# Altium project JESC.PrjPcb
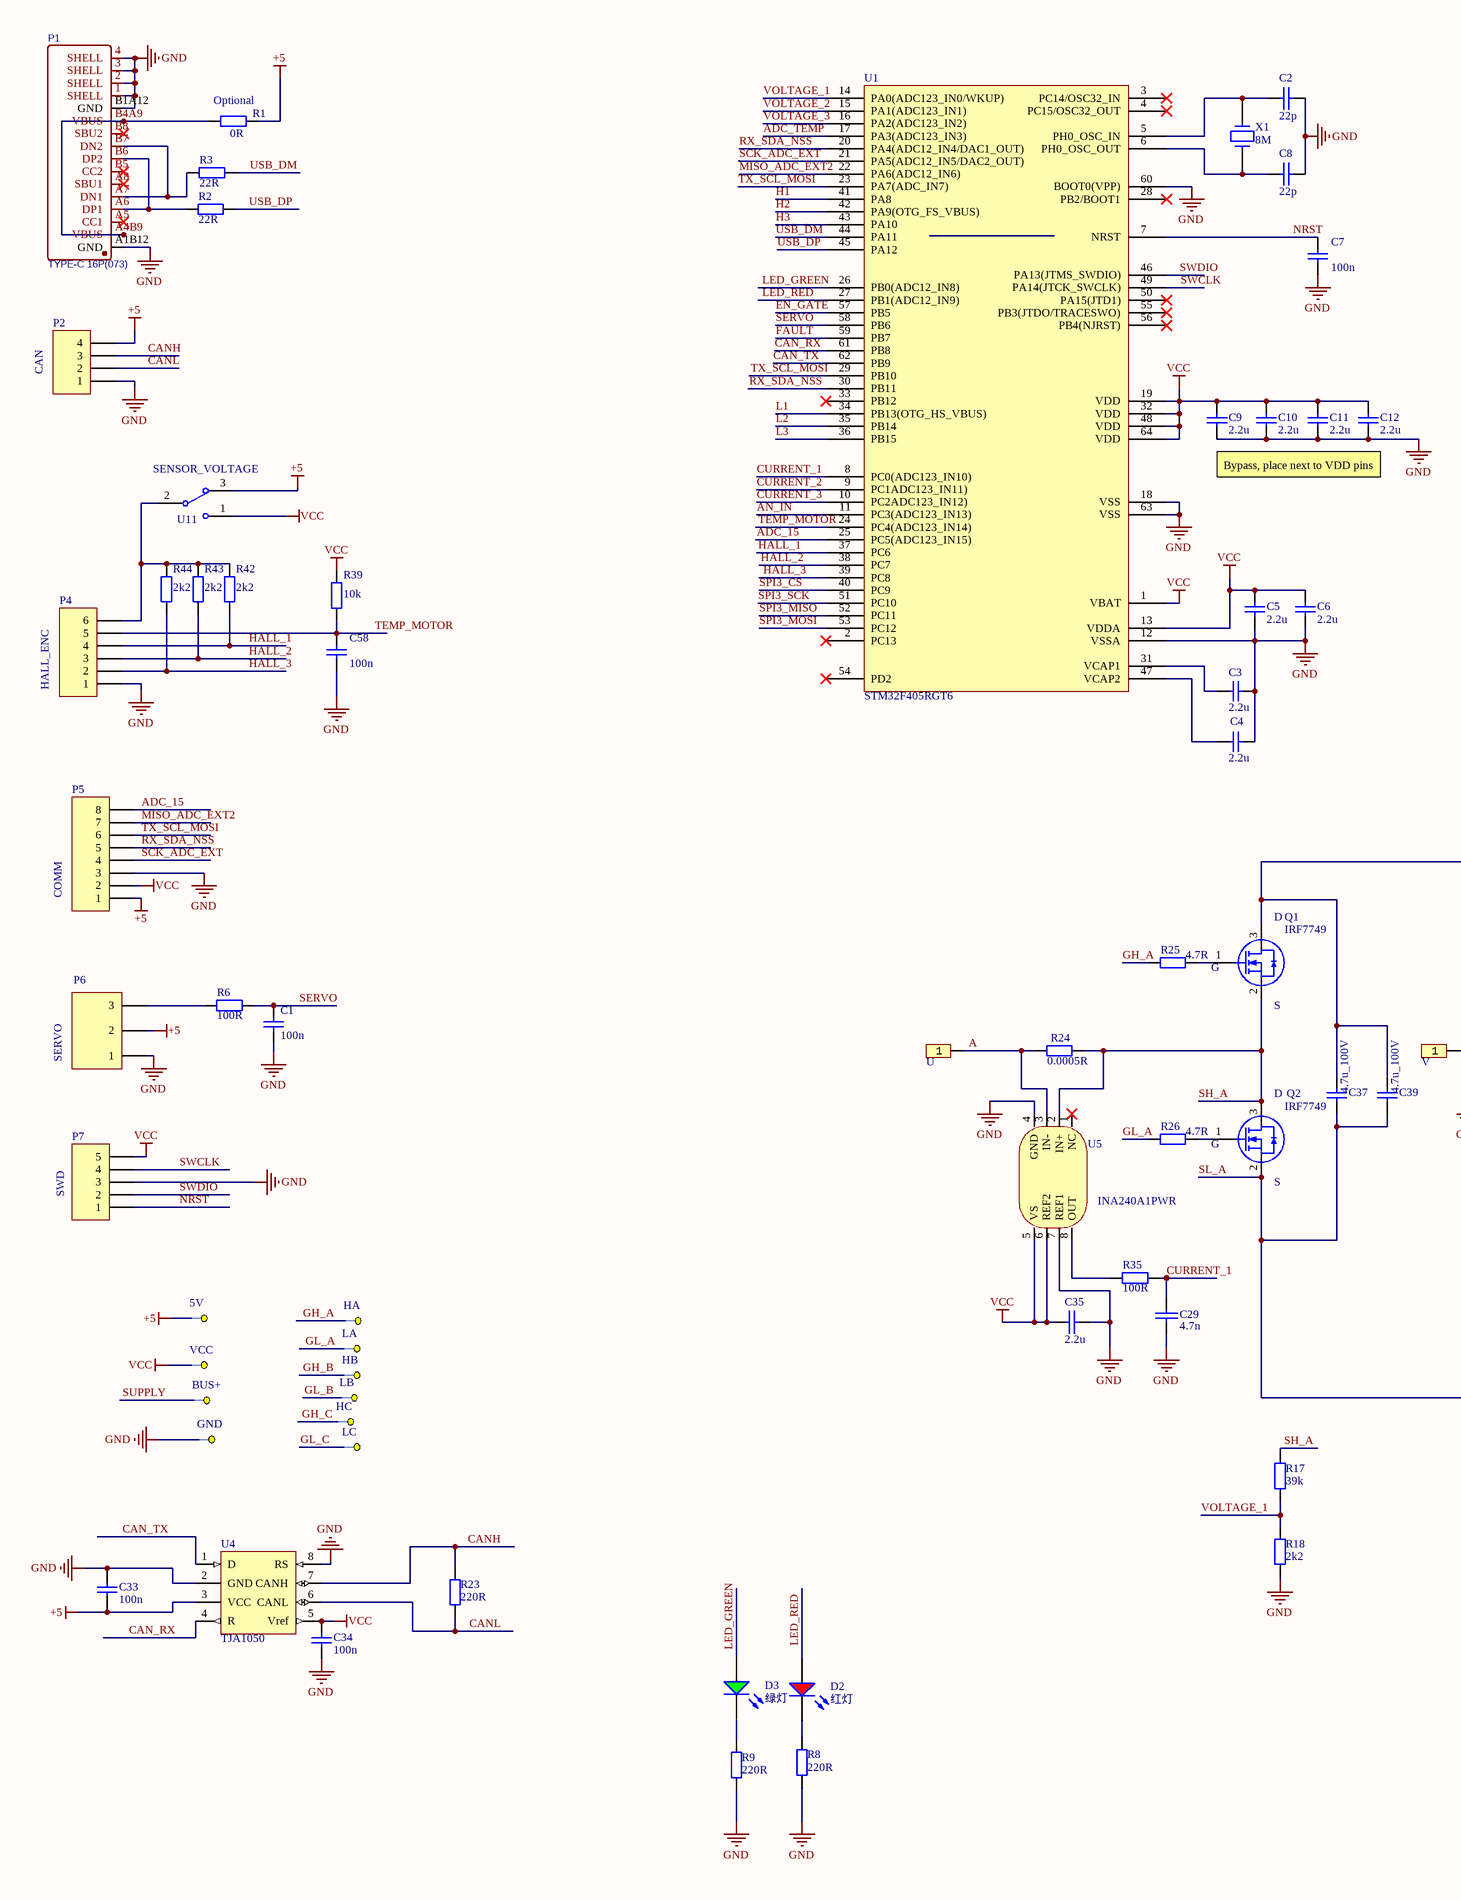
[diagram p0: VESC6.4.SchDoc, left]
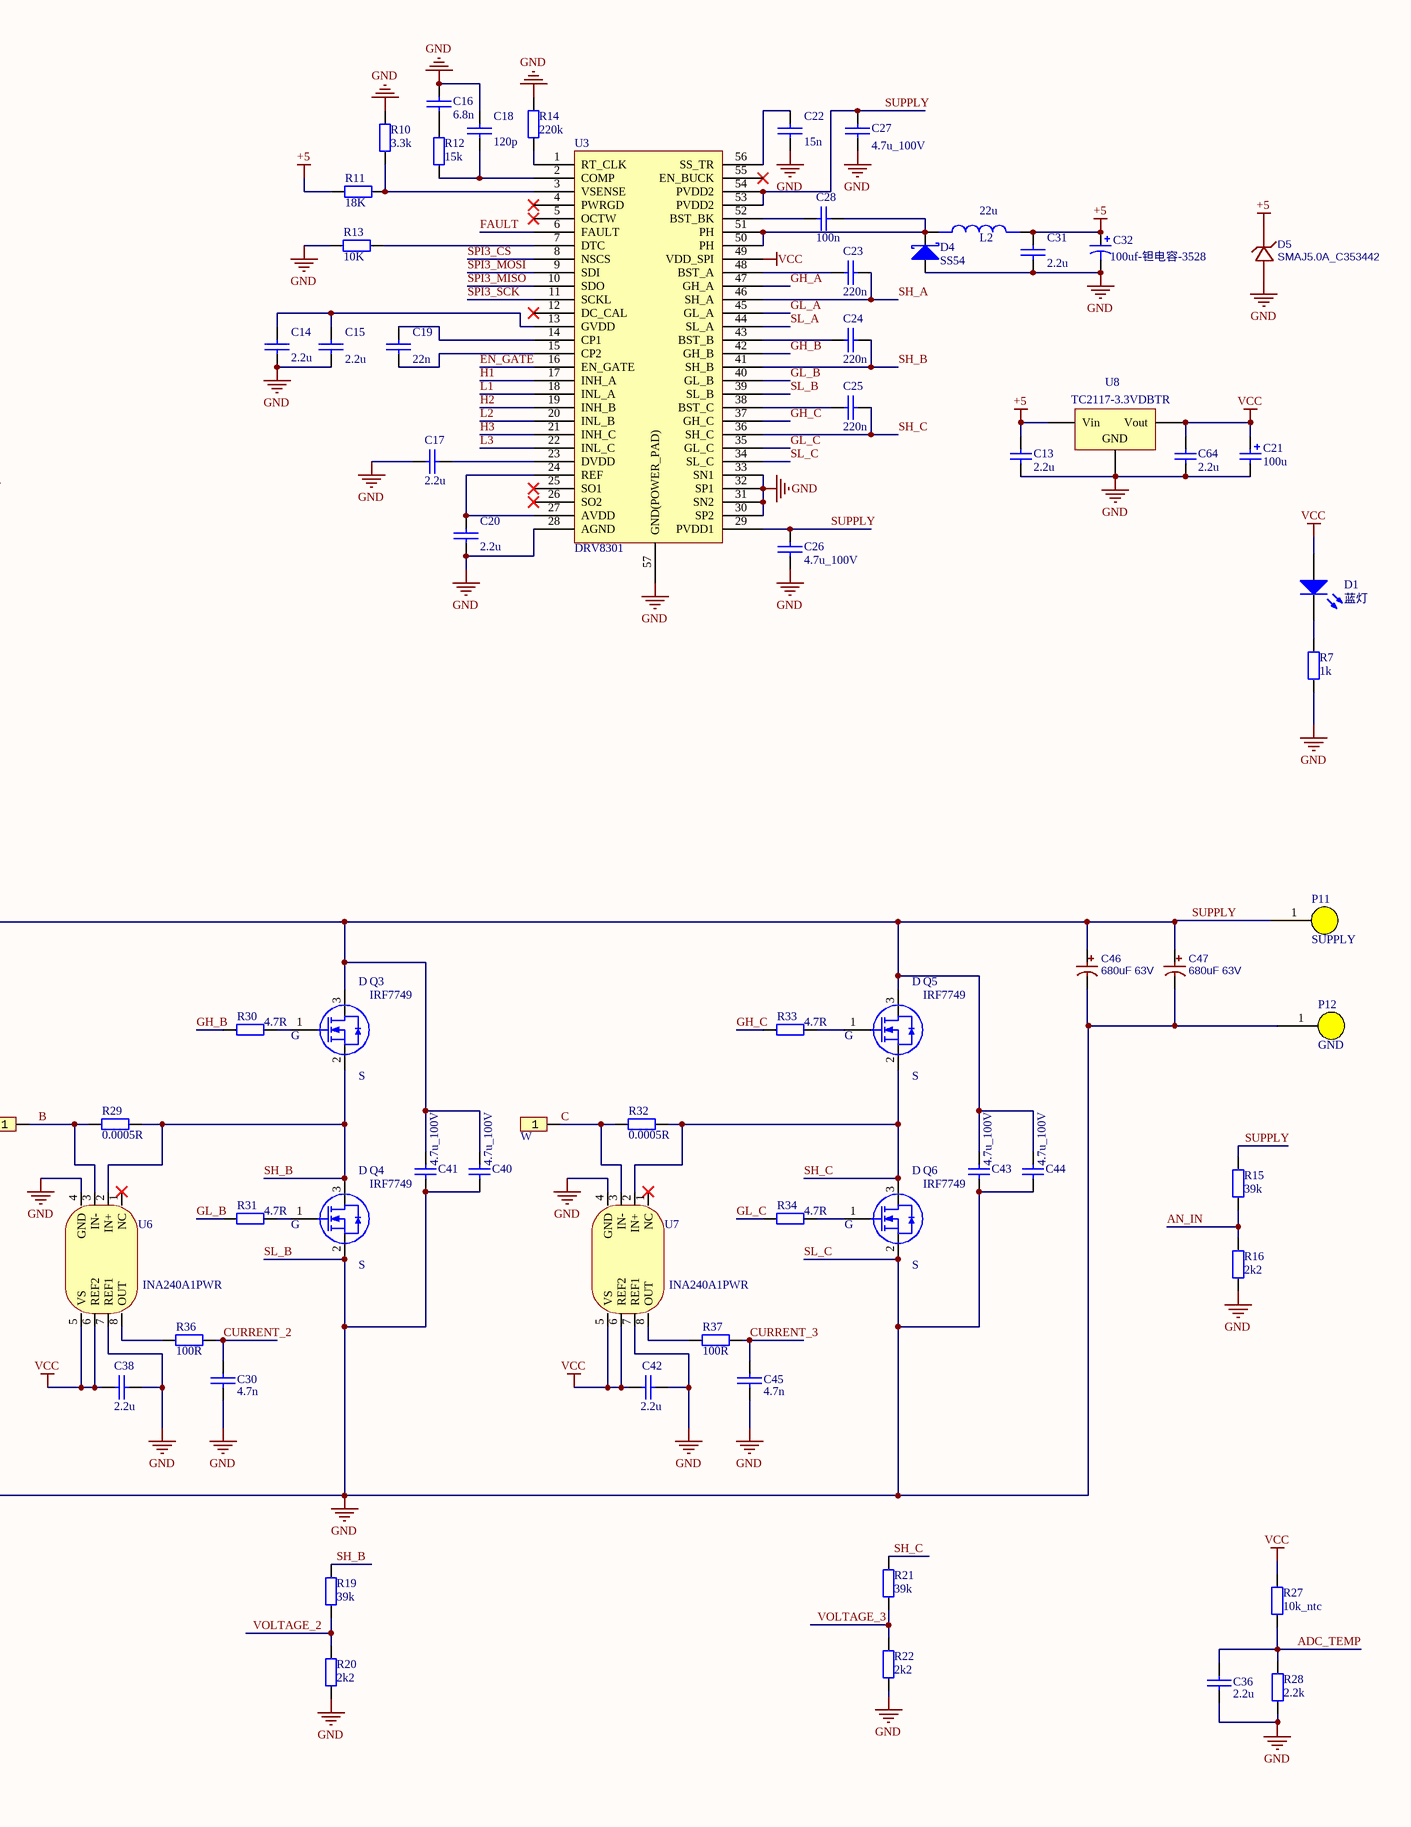
[diagram p1: VESC6.4.SchDoc, right]
1 sheet, 130 parts. Net scope: global (net labels, ports and power ports of the same name join across sheets).
Board file: VESC_6.4.1.PcbDoc

## Sheet VESC6.4.SchDoc
size A2; SheetNumber: 1; SheetTotal: 1

### Parts
5V  TEST  [TEST_2mm]  (value not drawn)  (no BOM)
BUS+  TEST  [TEST_2mm]  (value not drawn)  (no BOM)
C1  100n  [0603_C]
C2  22p  [0603_C]
C3  2.2u  [0603_C]
C4  2.2u  [0603_C]
C5  2.2u  [0603_C]
C6  2.2u  [0603_C]
C7  100n  [0603_C]
C8  22p  [0603_C]
C9  2.2u  [0603_C]
C10  2.2u  [0603_C]
C11  2.2u  [0603_C]
C12  2.2u  [0603_C]
C13  2.2u  [0603_C]
C14  2.2u  [0603_C]
C15  2.2u  [0603_C]
C16  6.8n  [0603_C]
C17  2.2u  [0603_C]
C18  120p  [0603_C]
C19  22n  [0603_C]
C20  2.2u  [0603_C]
C21  100u  [CASE-A_3216]
C22  15n  [0603_C]
C23  220n  [0603_C]
C24  220n  [0603_C]
C25  220n  [0603_C]
C26  4.7u_100V  [1206_C]
C27  4.7u_100V  [1206_C]
C28  100n  [0603_C]
C29  4.7n  [0603_C]
C30  4.7n  [0603_C]
C31  2.2u  [0603_C]
C32  100uf-钽电容-3528  [CAP-SMD_L3.5-W2.8-R-RD]
C33  100n  [0603_C]
C34  100n  [0603_C]
C35  2.2u  [0603_C]
C36  2.2u  [0603_C]
C37  4.7u_100V  [1206_C]
C38  2.2u  [0603_C]
C39  4.7u_100V  [1206_C]
C40  4.7u_100V  [1206_C]
C41  4.7u_100V  [1206_C]
C42  2.2u  [0603_C]
C43  4.7u_100V  [1206_C]
C44  4.7u_100V  [1206_C]
C45  4.7n  [0603_C]
C46  680uF 63V  [CAP-TH_BD12.5-P5.00-D1.2-FD]
C47  680uF 63V  [CAP-TH_BD12.5-P5.00-D1.2-FD]
C58  100n  [0603_C]
C64  2.2u  [0603_C]
D1  蓝灯  [0603_LED_S1]
D2  红灯  [0603_LED_S1]
D3  绿灯  [0603_LED_S1]
D4  SS54  [DIODE_3*5.3]
D5  SMAJ5.0A_C353442  [SMA_L4.4-W2.8-LS5.4-RD]
GND  TEST  [TEST_2mm]  (value not drawn)  (no BOM)
HA  TEST  [TEST_2mm]  (value not drawn)  (no BOM)
HB  TEST  [TEST_2mm]  (value not drawn)  (no BOM)
HC  TEST  [TEST_2mm]  (value not drawn)  (no BOM)
L2  22u  [IND-SMD_L5.0-W5.0]
LA  TEST  [TEST_2mm]  (value not drawn)  (no BOM)
LB  TEST  [TEST_2mm]  (value not drawn)  (no BOM)
LC  TEST  [TEST_2mm]  (value not drawn)  (no BOM)
P1  TYPE-C 16P(073)  [USB-C-SMD_16P - duplicate2]
P2  CAN  [CONN-SMD_4P-P1.25_GH1.25-4PLI]
P4  HALL_ENC  [CONN-SMD_6P-P1.25_WAFER-GH1.25-6PLB]
P5  COMM  [CONN-SMD_8P-P1.25_WAFER-GH1.25-8PLB]
P6  SERVO  [CONN-SMD_3P-P1.25_XUNPU_WAFER-GH1.25-3PLB]
P7  SWD  [CONN-SMD_5P-P1.25_XUNPU_WAFER-GH1.25-5PLB]
P11  SUPPLY  [Power Pad 6x6mm]
P12  GND  [Power Pad 6x6mm]
Q1  IRF7749  [DIRECTFET_L9.1-W7.0_IRF7759L2TRPBF]
Q2  IRF7749  [DIRECTFET_L9.1-W7.0_IRF7759L2TRPBF]
Q3  IRF7749  [DIRECTFET_L9.1-W7.0_IRF7759L2TRPBF]
Q4  IRF7749  [DIRECTFET_L9.1-W7.0_IRF7759L2TRPBF]
Q5  IRF7749  [DIRECTFET_L9.1-W7.0_IRF7759L2TRPBF]
Q6  IRF7749  [DIRECTFET_L9.1-W7.0_IRF7759L2TRPBF]
R1  0R  [0603_R]
R2  22R  [0603_R]
R3  22R  [0603_R]
R6  100R  [0603_R]
R7  1k  [0603_R]
R8  220R  [0603_R]
R9  220R  [0603_R]
R10  3.3k  [0603_R]
R11  18K  [0603_R]
R12  15k  [0603_R]
R13  10K  [0603_R]
R14  220k  [0603_R]
R15  39k  [0603_R]
R16  2k2  [0603_R]
R17  39k  [0603_R]
R18  2k2  [0603_R]
R19  39k  [0603_R]
R20  2k2  [0603_R]
R21  39k  [0603_R]
R22  2k2  [0603_R]
R23  value 220R  [0603_R]  (hidden comment: Res1)
R24  value 0.0005R  [R3920]  (hidden comment: Res1)
R25  value 4.7R  [0603_R]  (hidden comment: Res1)
R26  value 4.7R  [0603_R]  (hidden comment: Res1)
R27  10k_ntc  [0603_R]
R28  2.2k  [0603_R]
R29  value 0.0005R  [R3920]  (hidden comment: Res1)
R30  value 4.7R  [0603_R]  (hidden comment: Res1)
R31  value 4.7R  [0603_R]  (hidden comment: Res1)
R32  value 0.0005R  [R3920]  (hidden comment: Res1)
R33  value 4.7R  [0603_R]  (hidden comment: Res1)
R34  value 4.7R  [0603_R]  (hidden comment: Res1)
R35  100R  [0603_R]
R36  100R  [0603_R]
R37  100R  [0603_R]
R39  10k  [0603_R]
R42  2k2  [0603_R]
R43  2k2  [0603_R]
R44  2k2  [0603_R]
U  HDR-PAD  [MOTOR_PAD]  (value not drawn)
U1  STM32F405RGT6  [LQFP-64_10x10x05P]
U3  DRV8301  [DRV8301]
U4  TJA1050  [TJA1050]
U5  INA240A1PWR  [TSSOP-8_L4.4-W3.0-P0.65-LS6.4-BL]
U6  INA240A1PWR  [TSSOP-8_L4.4-W3.0-P0.65-LS6.4-BL]
U7  INA240A1PWR  [TSSOP-8_L4.4-W3.0-P0.65-LS6.4-BL]
U8  TC2117-3.3VDBTR  [SOT-223]
U11  MSK-12C01-07  [MSK-12C01-07]  (value not drawn)
V  HDR-PAD  [MOTOR_PAD]  (value not drawn)
VCC  TEST  [TEST_2mm]  (value not drawn)  (no BOM)
W  HDR-PAD  [MOTOR_PAD]  (value not drawn)
X1  8M  [晶振]

### Nets
+5: 5V.1 C13.2 C31.2 C32.1 C33.1 D5.1(C) L2.2(Pri-) P2.4 P5.1 P6.2 R1.1 R11.1 U4.3(VCC) U8.3(Vin) U11.3
SL_A: C1.1 C2.1 C3.1 C4.1 C5.1 C6.1 C7.1 C8.1 C9.2 C10.2 C11.2 C12.2 C13.1 C14.1 C15.1 C16.2 C17.1 C18.2 C20.1 C21.2 C22.1 C26.1 C27.1 C29.2 C30.2 C31.1 C32.2 C33.2 C34.2 C35.1 C36.2 C37.1 C38.1 C39.1 C40.1 C41.1 C42.1 C43.1 C44.1 C45.2 C46.2 C47.2 C58.1 C64.1 D4.1(A) D5.2(A) GND.1 P1.1(SHELL) P1.2(SHELL) P1.3(SHELL) P1.4(SHELL) P1.A1B12(GND) P1.B1A12(GND) P2.1 P4.1 P5.3 P6.1 P7.3 P12.1 Q2.2(S) Q4.2(S) Q6.2(S) R7.1 R8.1 R9.1 R10.2 R13.1 R14.2 R16.2 R18.2 R20.2 R22.2 R28.2 U1.12(VSSA) U1.18(VSS) U1.60(BOOT0(VPP)) U1.63(VSS) U3.28(AGND) U3.30(SP2) U3.31(SN2) U3.32(SP1) U3.33(SN1) U3.34(SL_C) U3.39(SL_B) U3.44(SL_A) U3.57(GND(POWER_PAD)) U4.2(GND) U4.8(RS) U5.4(GND) U5.7(REF1) U6.4(GND) U6.7(REF1) U7.4(GND) U7.7(REF1) U8.1(GND)  [also labelled GND, SL_B, SL_C]
VCC: C5.2 C6.2 C9.1 C10.1 C11.1 C12.1 C21.1 C34.1 C35.2 C38.2 C42.2 C64.2 D1.A P5.2 P7.5 R27.2 R39.1 U1.1(VBAT) U1.13(VDDA) U1.19(VDD) U1.32(VDD) U1.48(VDD) U1.64(VDD) U3.49(VDD_SPI) U4.5(Vref) U5.5(VS) U5.6(REF2) U6.5(VS) U6.6(REF2) U7.5(VS) U7.6(REF2) U8.2(Vout) U11.1 VCC.1
A: R24.2 U.1 U5.3(IN-)
ADC_15: P5.8 U1.25(PC5(ADC123_IN15))
ADC_TEMP: C36.1 R27.1 R28.1 U1.17(PA3(ADC123_IN3))
AN_IN: R15.1 R16.1 U1.11(PC3(ADC123_IN13))
B: R29.2 U6.3(IN-) V.1
C: R32.2 U7.3(IN-) W.1
CAN_RX: U1.61(PB8) U4.4(R)
CAN_TX: U1.62(PB9) U4.1(D)
CANH: P2.3 R23.2 U4.7(CANH)
CANL: P2.2 R23.1 U4.6(CANL)
CURRENT_1: C29.1 R35.1 U1.8(PC0(ADC123_IN10))
CURRENT_2: C30.1 R36.1 U1.9(PC1ADC123_IN11))
CURRENT_3: C45.1 R37.1 U1.10(PC2ADC123_IN12))
EN_GATE: U1.57(PB5) U3.16(EN_GATE)
FAULT: U1.59(PB7) U3.6(FAULT)
GH_A: HA.1 R25.1 U3.47(GH_A)
GH_B: HB.1 R30.1 U3.42(GH_B)
GH_C: HC.1 R33.1 U3.37(GH_C)
GL_A: LA.1 R26.1 U3.45(GL_A)
GL_B: LB.1 R31.1 U3.40(GL_B)
GL_C: LC.1 R34.1 U3.35(GL_C)
H1: U1.41(PA8) U3.17(INH_A)
H2: U1.42(PA9(OTG_FS_VBUS)) U3.19(INH_B)
H3: U1.43(PA10) U3.21(INH_C)
HALL_1: P4.4 R42.2 U1.37(PC6)
HALL_2: P4.3 R43.2 U1.38(PC7)
HALL_3: P4.2 R44.2 U1.39(PC8)
L1: U1.34(PB13(OTG_HS_VBUS)) U3.18(INL_A)
L2: U1.35(PB14) U3.20(INL_B)
L3: U1.36(PB15) U3.22(INL_C)
LED_GREEN: D3.A U1.26(PB0(ADC12_IN8))
LED_RED: D2.A U1.27(PB1(ADC12_IN9))
MISO_ADC_EXT2: P5.7 U1.22(PA6(ADC12_IN6))
NRST: C7.2 P7.1 U1.7(NRST)
RX_SDA_NSS: P5.5 U1.20(PA4(ADC12_IN4/DAC1_OUT)) U1.30(PB11)
SCK_ADC_EXT: P5.4 U1.21(PA5(ADC12_IN5/DAC2_OUT))
SERVO: C1.2 R6.1 U1.58(PB6)
SH_A: C23.1 Q1.2(S) Q2.3(D) R17.2 R24.1 U3.46(SH_A) U5.2(IN+)
SH_B: C24.1 Q3.2(S) Q4.3(D) R19.2 R29.1 U3.41(SH_B) U6.2(IN+)
SH_C: C25.1 Q5.2(S) Q6.3(D) R21.2 R32.1 U3.36(SH_C) U7.2(IN+)
SPI3_CS: U1.40(PC9) U3.8(NSCS)
SPI3_MISO: U1.52(PC11) U3.10(SDO)
SPI3_MOSI: U1.53(PC12) U3.9(SDI)
SPI3_SCK: U1.51(PC10) U3.11(SCKL)
SUPPLY: BUS+.1 C26.2 C27.2 C37.2 C39.2 C40.2 C41.2 C43.2 C44.2 C46.1 C47.1 P11.1 Q1.3(D) Q3.3(D) Q5.3(D) R15.2 U3.29(PVDD1) U3.53(PVDD2) U3.54(PVDD2)
SWCLK: P7.4 U1.49(PA14(JTCK_SWCLK))
SWDIO: P7.2 U1.46(PA13(JTMS_SWDIO))
TEMP_MOTOR: C58.2 P4.5 R39.2 U1.24(PC4(ADC123_IN14))
TX_SCL_MOSI: P5.6 U1.23(PA7(ADC_IN7)) U1.29(PB10)
USB_DM: R3.1 U1.44(PA11)
USB_DP: R2.1 U1.45(PA12)
VOLTAGE_1: R17.1 R18.1 U1.14(PA0(ADC123_IN0/WKUP))
VOLTAGE_2: R19.1 R20.1 U1.15(PA1(ADC123_IN1))
VOLTAGE_3: R21.1 R22.1 U1.16(PA2(ADC123_IN2))
NetC2_2: C2.2 U1.5(PH0_OSC_IN) X1.1
NetC3_2: C3.2 U1.31(VCAP1)
NetC4_2: C4.2 U1.47(VCAP2)
NetC8_2: C8.2 U1.6(PH0_OSC_OUT) X1.2
NetC14_2: C14.2 C15.2 U3.13(GVDD)
NetC16_1: C16.1 R12.2
NetC17_2: C17.2 U3.23(DVDD)
NetC18_1: C18.1 R12.1 U3.2(COMP)
NetC19_1: C19.1 U3.14(CP1)
NetC19_2: C19.2 U3.15(CP2)
NetC20_2: C20.2 U3.24(REF) U3.27(AVDD)
NetC22_2: C22.2 U3.56(SS_TR)
NetC23_2: C23.2 U3.48(BST_A)
NetC24_2: C24.2 U3.43(BST_B)
NetC25_2: C25.2 U3.38(BST_C)
NetC28_1: C28.1 D4.2(K) L2.1(Pri-) U3.50(PH) U3.51(PH)
NetC28_2: C28.2 U3.52(BST_BK)
NetD1_K: D1.K R7.2
NetD2_K: D2.K R8.2
NetD3_K: D3.K R9.2
NetP1_A4B9: P1.A4B9(VBUS) P1.B4A9(VBUS) R1.2
NetP1_A6: P1.A6(DP1) P1.B6(DP2) R2.2
NetP1_A7: P1.A7(DN1) P1.B7(DN2) R3.2
NetP4_6: P4.6 R42.1 R43.1 R44.1 U11.2
NetP6_3: P6.3 R6.2
NetQ1_1: Q1.1(G) R25.2
NetQ2_1: Q2.1(G) R26.2
NetQ3_1: Q3.1(G) R30.2
NetQ4_1: Q4.1(G) R31.2
NetQ5_1: Q5.1(G) R33.2
NetQ6_1: Q6.1(G) R34.2
NetR10_1: R10.1 R11.2 U3.3(VSENSE)
NetR13_2: R13.2 U3.7(DTC)
NetR14_1: R14.1 U3.1(RT_CLK)
NetR35_2: R35.2 U5.8(OUT)
NetR36_2: R36.2 U6.8(OUT)
NetR37_2: R37.2 U7.8(OUT)

Not connected (* = marked no-connect by the designer): P1 A5(CC1)* A8(SBU1)* B5(CC2)* B8(SBU2)*; U1 2(PC13)* 3(PC14/OSC32_IN)* 4(PC15/OSC32_OUT)* 28(PB2/BOOT1)* 33(PB12)* 50(PA15(JTD1))* 54(PD2)* 55(PB3(JTDO/TRACESWO))* 56(PB4(NJRST))*; U3 4(PWRGD)* 5(OCTW)* 12(DC_CAL)* 25(SO1)* 26(SO2)* 55(EN_BUCK)*; U5 1(NC)*; U6 1(NC)*; U7 1(NC)*

### Notes on the sheet
- (near R1) Optional
- (near U11) SENSOR_VOLTAGE
- Bypass, place next to VDD pins

### Library data of the parts
5V BUS+ GND HA HB HC LA LB LC VCC = TEST: 测试点
C1 C7 C58 = 0603 100nF (104) 10% 50V: 贴片电容; ComponentLink1Description: 供应商链接; ComponentLink1URL: http://www.szlcsc.com/product/details_15331.html; Package: 0603; Supplier: LC; SuppliersPartNumber: C14663
C2 C8 = CAP: 贴片电容; Value: 22p
C3-C6 C9-C13 C64 = 0603 2.2uF (225) 10% 16V: 贴片电容; ComponentLink1Description: 供应商链接; ComponentLink1URL: http://www.szlcsc.com/product/details_24366.html; Package: 0603; Supplier: LC; SuppliersPartNumber: C23630
C14-C20 C22-C31 C35 C36 C38 C42 C45 = CAP
  C14 C15 C17 C20 C31 C35 C36 C38 C42: Value: 2.2u
  C16: Value: 6.8n
  C18: Value: 120p
  C19: Value: 22n
  C22: Value: 15n
  C23-C25: Value: 220n
  C26 C27: Value: 4.7u_100V
  C28: Value: 100n
  C29 C30 C45: Value: 4.7n
C21 = 3528 100uF (107) 10% 6.3V: 钽电容; ComponentLink1Description: 供应商链接; ComponentLink1URL: http://www.szlcsc.com/product/details_16815.html; Package: 3528; Supplier: LC; SuppliersPartNumber: C16133
C32 = CAP_HER: Value: 100uf-钽电容-3528
C33 = CAP: Capacitor; Value: 104; Published: 8-Jun-2000; LatestRevisionDate: 17-Jul-2002; LatestRevisionNote: Re-released for DXP Platform.; PackageReference: RAD-0.3; Publisher: Altium Limited
C34 = CAP: 贴片电容; Value: 104; Published: 8-Jun-2000; LatestRevisionDate: 17-Jul-2002; LatestRevisionNote: Re-released for DXP Platform.; PackageReference: RAD-0.3; Publisher: Altium Limited
C37 C39-C41 C43 C44 = Cap_6: 无极性电容; Published: 8-Jun-2000; LatestRevisionDate: 17-Jul-2002; LatestRevisionNote: Re-released for DXP Platform.; PackageReference: RAD-0.3; Publisher: Altium Limited; Value: 4.7u_100V
C46 C47 = 680uF: BOM_Manufacturer: AISHI; BOM_Manufacturer Part: ERR1JM681W25OT; nameAlias: Capacitance; BOM_Supplier: LCSC; BOM_Supplier Part: C106632; spicePre: C; spiceSymbolName: ERR1JM681W25OT
D1 = 0603 蓝灯: 发光二极管; ComponentLink1Description: 供应商链接; ComponentLink1URL: http://www.szlcsc.com/product/details_73150.html; Package: 0603; Supplier: LC; SuppliersPartNumber: C72041
D2 = 0603 红灯: 发光二极管; ComponentLink1Description: 供应商链接; ComponentLink1URL: http://www.szlcsc.com/product/details_2659.html; Package: 0603; Supplier: LC; SuppliersPartNumber: C2286
D3 = 0603 绿灯: 发光二极管; ComponentLink1Description: 供应商链接; ComponentLink1URL: http://www.szlcsc.com/product/details_73152.html; Package: 0603; Supplier: LC; SuppliersPartNumber: C72043
D4 = D Schottky: Schottky Diode; Published: 8-Jun-2000; LatestRevisionDate: 17-Jul-2002; LatestRevisionNote: Re-released for DXP Platform.; PackageReference: SMB; Publisher: Altium Limited; PackageDescription: DO-214-AA/SMB; 2 C-Bend Leads; Body 5.3 x 3.6 mm, inc. leads (LxW); Code_JEDEC: DO-214-AA
D5 = SMAJ5.0A_C353442: BOM_Manufacturer: Shandong Jingdao Microelectronics; Contributor: LCSC; BOM_Supplier: LCSC; BOM_Supplier Part: C353442; BOM_Manufacturer Part: SMAJ5.0A; spicePre: D; spiceSymbolName: SMAJ5.0A_C353442
L2 = IND
P1 = TYPE-C 16P(073)_1: BOM_Manufacturer: SHOU HAN; Contributor: LCSC; BOM_Supplier: LCSC; BOM_Supplier Part: C668624; BOM_Manufacturer Part: TYPE-C 16P(073); spicePre: U; spiceSymbolName: TYPE-C 16P(073)
P2 = Header 4: Header, 4-Pin; LatestRevisionDate: 17-Jul-2002; LatestRevisionNote: Re-released for DXP Platform.; Publisher: Altium Limited
P4 = Header 6: Header, 6-Pin; LatestRevisionDate: 17-Jul-2002; LatestRevisionNote: Re-released for DXP Platform.; Publisher: Altium Limited
P5 = Header 8: Header, 8-Pin; LatestRevisionDate: 17-Jul-2002; LatestRevisionNote: Re-released for DXP Platform.; Publisher: Altium Limited
P6 = Header 3: 接插件; LatestRevisionDate: 17-Jul-2002; LatestRevisionNote: Re-released for DXP Platform.; Publisher: Altium Limited
P7 = Header 5: Header, 5-Pin; LatestRevisionDate: 17-Jul-2002; LatestRevisionNote: Re-released for DXP Platform.; Publisher: Altium Limited
P11 = PadS
P12 = PadS_1
Q1-Q6 = IRF7749: MOS(场效应管)
R1-R3 R6-R12 R14-R22 R27 R28 R35-R37 R42-R44 = Res2: Resistor; Value: 10K; Published: 8-Jun-2000; LatestRevisionDate: 17-Jul-2002; LatestRevisionNote: Re-released for DXP Platform.; PackageReference: AXIAL-0.4; Publisher: Altium Limited; PackageDescription: Axial Device, Thru-Hole; 2 Leads; 0.4 in Pin Spacing
R13 R39 = Res2: Resistor; Published: 8-Jun-2000; LatestRevisionDate: 17-Jul-2002; LatestRevisionNote: Re-released for DXP Platform.; PackageReference: AXIAL-0.4; Publisher: Altium Limited; PackageDescription: Axial Device, Thru-Hole; 2 Leads; 0.4 in Pin Spacing; Value: 10K
R23-R26 R29-R34 = Res1: 贴片电阻; Published: 8-Jun-2000; LatestRevisionDate: 17-Jul-2002; LatestRevisionNote: Re-released for DXP Platform.; PackageReference: AXIAL-0.4; Publisher: Altium Limited
U V W = HDR-PAD_2.54: Header
U3 = DRV8301: 预驱
U5-U7 = INA240A1PWR: INA240 电压输出、高/低侧测量、双向零漂移系列; Manufacturer: TI(德州仪器); Add into BOM: yes; Name: INA240A1PWR; Symbol: INA240A1PWR; Device: INA240A1PWR; LCSC Part Name: INA240A1PWR; Supplier Part: C93965; Manufacturer Part: INA240A1PWR; Supplier Footprint: TSSOP-8_3x4.4x065P; JLCPCB Part Class: 扩展库; Datasheet: https://atta.szlcsc.com/upload/public/pdf/source/20180125/C93965_15168617716381301969.pdf; Supplier: LCSC; Convert to PCB: yes
U8 = SOT-223 AMS1117-3.3: 低压差线性稳压(LDO); ComponentLink1Description: 供应商链接; ComponentLink1URL: http://www.szlcsc.com/product/details_6652.html; Package: SOT-223; Supplier: LC; SuppliersPartNumber: C6186
X1 = CRYSTAL: XTAL_SMD5032 Crystal